# EAGLE design FilterTestBoard (EAGLE 9.2.1)
DESIGNER: Hendrik Melse; PART_NUMBER: 68-0011; PROJECT: Cougs In Space; REV: 1.0.0
Assembly variants: 0.1Hz/100Hz

## Sheet 1 of 2
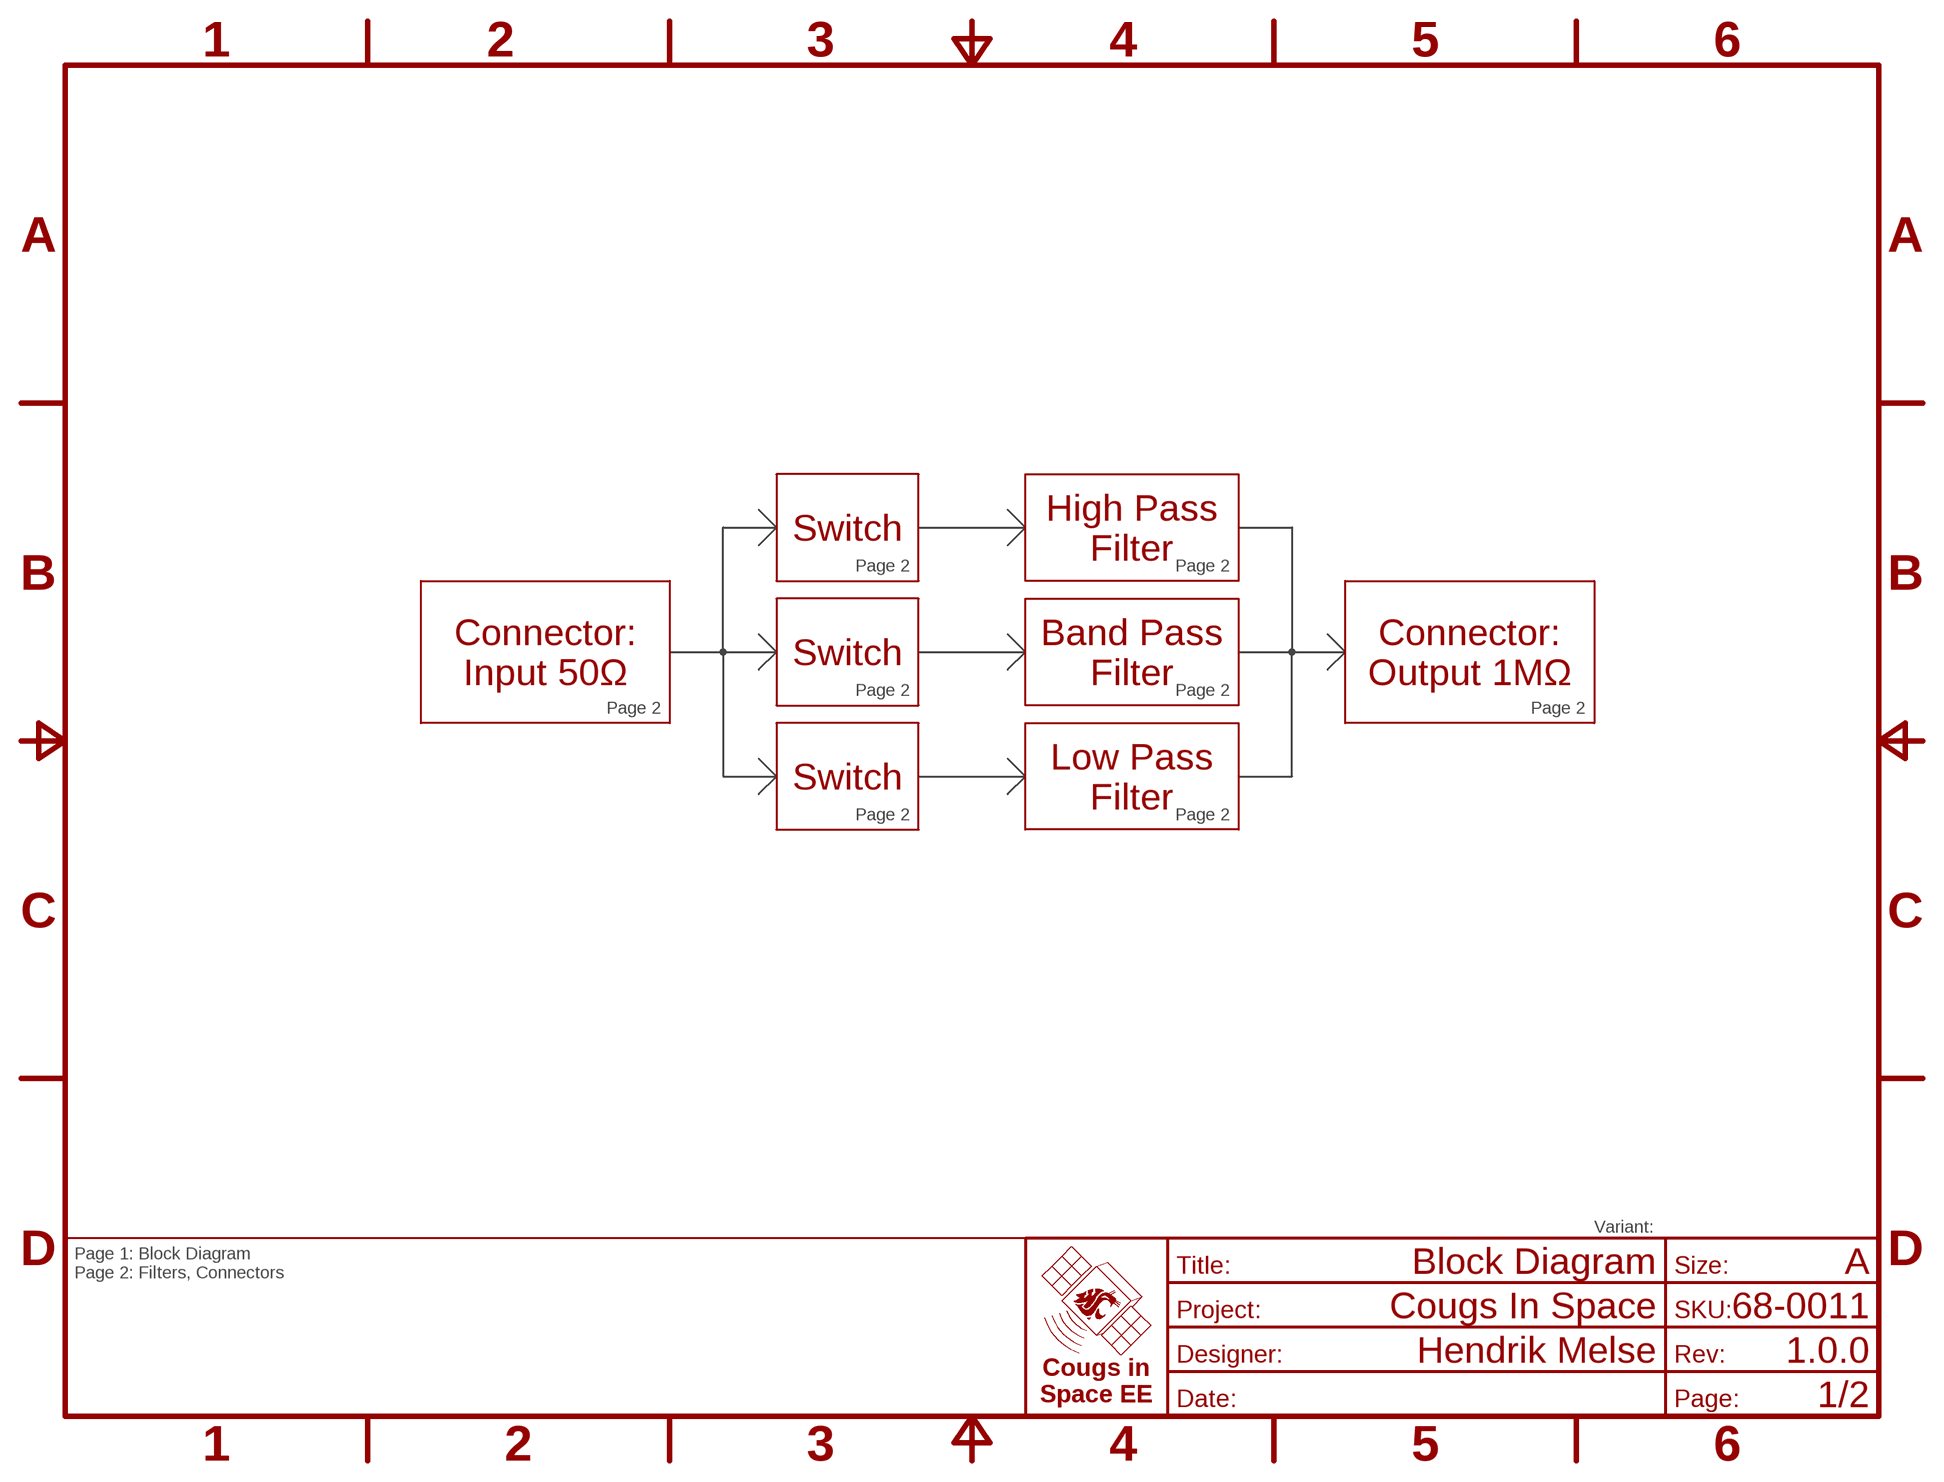
[diagram p0: schematic, sheet 1]
FRAME1 (FRAME-A): TITLE: Block Diagram

### Notes on the sheet
- Switch
- High Pass
  Filter
- Page 2 | Page 2
- Connector:
  Input 50Ω
- Switch
- Band Pass
  Filter
- Connector:
  Output 1MΩ
- Page 2 | Page 2
- Page 2 | Page 2
- Switch
- Low Pass
  Filter
- Page 2 | Page 2
- Variant:
- Page 1: Block Diagram
  Page 2: Filters, Connectors

## Sheet 2 of 2
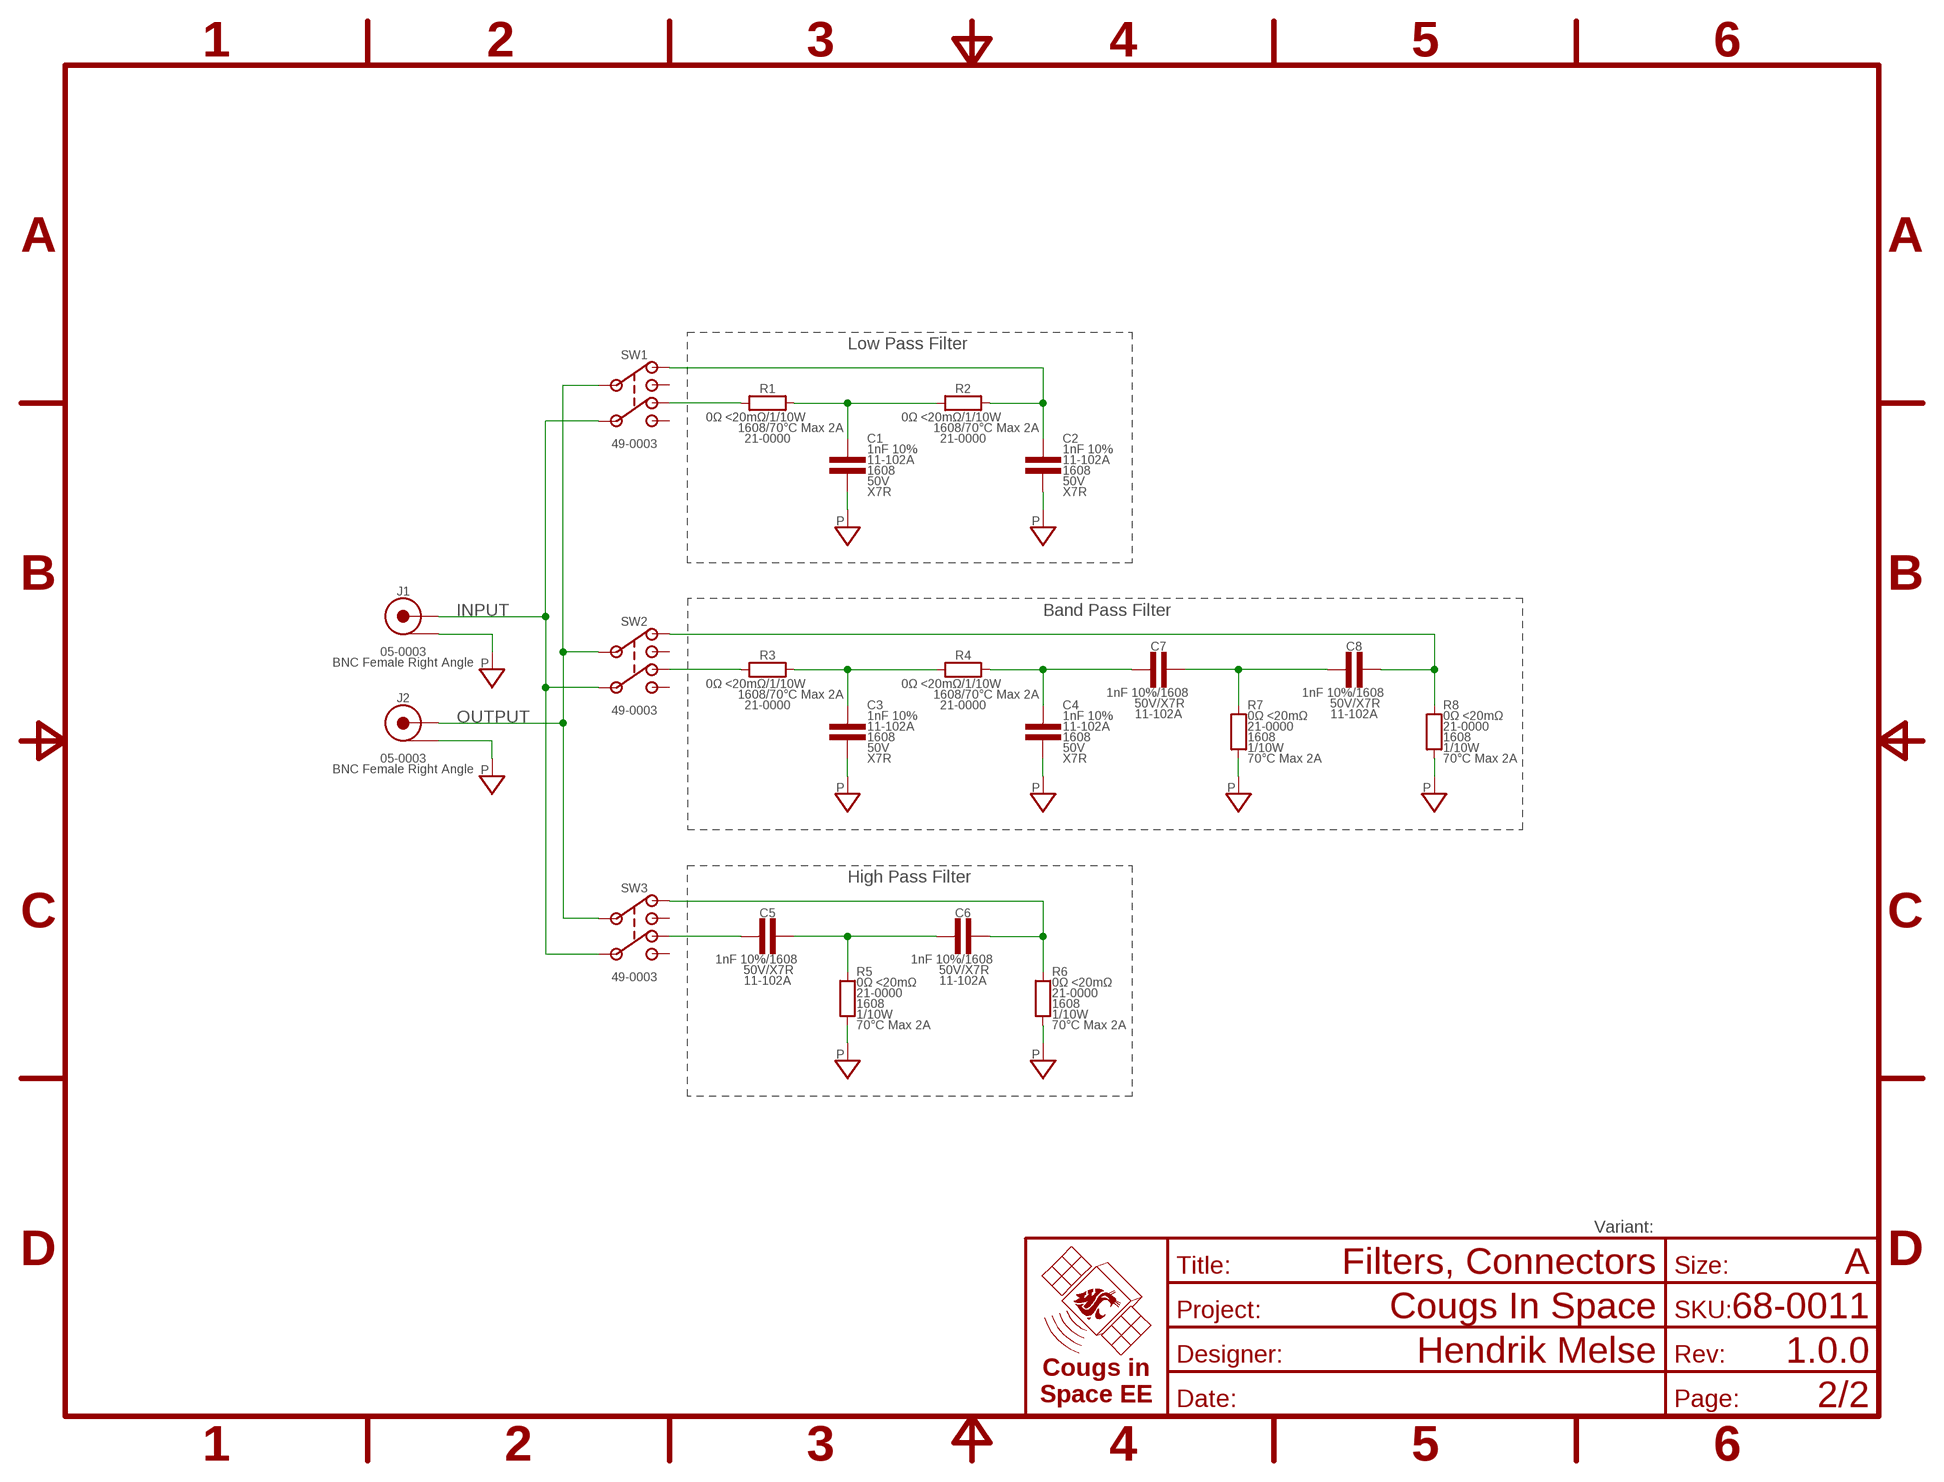
[diagram p1: schematic, sheet 2]
FRAME2 (FRAME-A): TITLE: Filters, Connectors

### Parts
C1  1nF 10%  CAP-V-1NF-1608  [1608]  (variant 0.1Hz/100Hz: 10µF 10%)
C2  1nF 10%  CAP-V-1NF-1608  [1608]  (variant 0.1Hz/100Hz: 10µF 10%)
C3  1nF 10%  CAP-V-1NF-1608  [1608]  (variant 0.1Hz/100Hz: 10µF 10%)
C4  1nF 10%  CAP-V-1NF-1608  [1608]  (variant 0.1Hz/100Hz: 10µF 10%)
C5  1nF 10%  CAP-H-1NF-1608  [1608]  (variant 0.1Hz/100Hz: 10µF 10%)
C6  1nF 10%  CAP-H-1NF-1608  [1608]  (variant 0.1Hz/100Hz: 10µF 10%)
C7  1nF 10%  CAP-H-1NF-1608  [1608]  (variant 0.1Hz/100Hz: 10µF 10%)
C8  1nF 10%  CAP-H-1NF-1608  [1608]  (variant 0.1Hz/100Hz: 10µF 10%)
J1  COAX-BNC-T-R  [BNC-T-R]
J2  COAX-BNC-T-R  [BNC-T-R]
R1  0Ω <20mΩ  RES-H-0-1608  [1608]  (variant 0.1Hz/100Hz: 158kΩ 0.1%)
R2  0Ω <20mΩ  RES-H-0-1608  [1608]  (variant 0.1Hz/100Hz: 158kΩ 0.1%)
R3  0Ω <20mΩ  RES-H-0-1608  [1608]  (variant 0.1Hz/100Hz: 158Ω 1%)
R4  0Ω <20mΩ  RES-H-0-1608  [1608]  (variant 0.1Hz/100Hz: 158Ω 1%)
R5  0Ω <20mΩ  RES-V-0-1608  [1608]  (variant 0.1Hz/100Hz: 158Ω 1%)
R6  0Ω <20mΩ  RES-V-0-1608  [1608]  (variant 0.1Hz/100Hz: 158Ω 1%)
R7  0Ω <20mΩ  RES-V-0-1608  [1608]  (variant 0.1Hz/100Hz: 158kΩ 0.1%)
R8  0Ω <20mΩ  RES-V-0-1608  [1608]  (variant 0.1Hz/100Hz: 158kΩ 0.1%)
SW1  SWITCH-DPDT-100DP1T1B1M2QE  [100DP1T1B1M2QE]
SW2  SWITCH-DPDT-100DP1T1B1M2QE  [100DP1T1B1M2QE]
SW3  SWITCH-DPDT-100DP1T1B1M2QE  [100DP1T1B1M2QE]

### Nets
BAND_IN: R3.1 SW2.1-B
BAND_INT0: C3.1 R3.2 R4.1
BAND_INT1: C4.1 C7.1 R4.2
BAND_INT2: C7.2 C8.1 R7.2
BAND_OUT: C8.2 R8.2 SW2.1-A
HIGH_IN: C5.1 SW3.1-B
HIGH_INT: C5.2 C6.1 R5.2
HIGH_OUT: C6.2 R6.2 SW3.1-A
INPUT: J1.CENTER SW1.COM-B SW2.COM-B SW3.COM-B
LOW_IN: R1.1 SW1.1-B
LOW_INT: C1.1 R1.2 R2.1
LOW_OUT: C2.1 R2.2 SW1.1-A
OUTPUT: J2.CENTER SW1.COM-A SW2.COM-A SW3.COM-A
PGND: C1.2 C2.2 C3.2 C4.2 J1.SHIELD J2.SHIELD R5.1 R6.1 R7.1 R8.1
Unconnected: SW1.2-A SW1.2-B SW2.2-A SW2.2-B SW3.2-A SW3.2-B

### Notes on the sheet
- Low Pass Filter
- Band Pass Filter
- High Pass Filter
- Variant:

## Library data of the parts
C1-C4 = CougsInSpace-Capacitors:CAP-V: Capacitor - Vertical Orientation; PACKAGE: 1608; SKU: 11-102A; TEMP: X7R; VOLTAGE: 50V
C5-C8 = CougsInSpace-Capacitors:CAP-H: Capacitor - Horizontal Orientation; PACKAGE: 1608; SKU: 11-102A; TEMP: X7R; VOLTAGE: 50V
J1 J2 = CougsInSpace-Connectors:COAX: Coax Connector; PACKAGE: BNC Female Right Angle; SKU: 05-0003
R1-R4 = CougsInSpace-Resistors:RES-H: Resistor Horizontal; PACKAGE: 1608; POWER: 1/10W; SKU: 21-0000; TEMP: 70°C Max 2A
R5-R8 = CougsInSpace-Resistors:RES-V: Resistor Vertical; PACKAGE: 1608; POWER: 1/10W; SKU: 21-0000; TEMP: 70°C Max 2A
SW1-SW3 = CougsInSpace-Switches:SWITCH-DPDT: Double Pole Double Throw - DPDT 100DP1T1B1M2QE <https://github.com/CougsInSpace/Resources/blob/master/SupplierDocuments/E-Switch/T121009_DPDT.pdf>; SKU: 49-0003

## Board
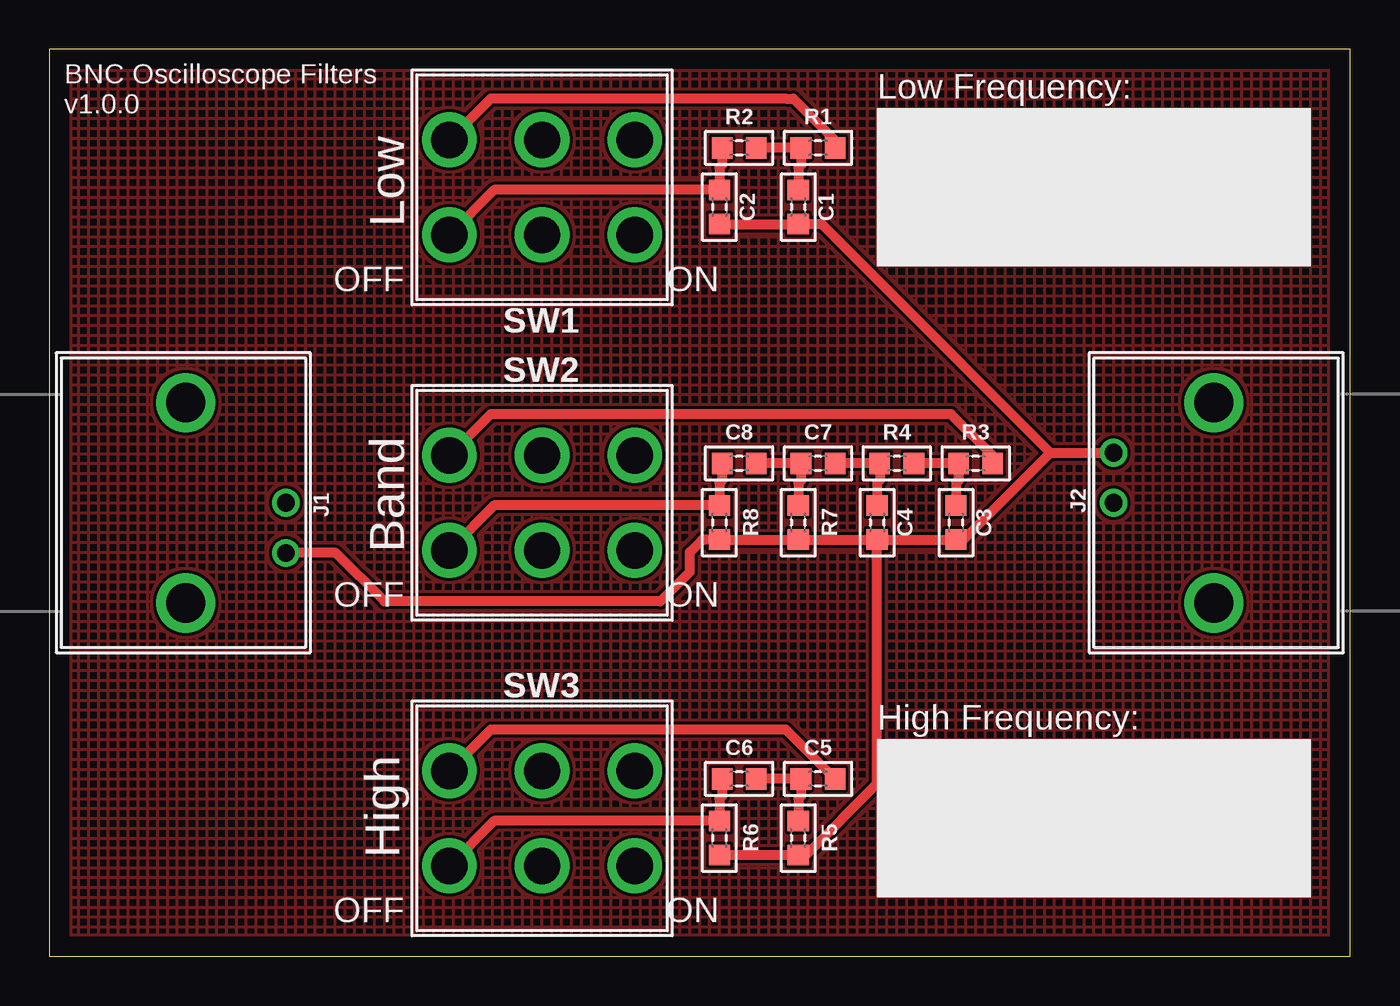
[diagram p2: board, top side]
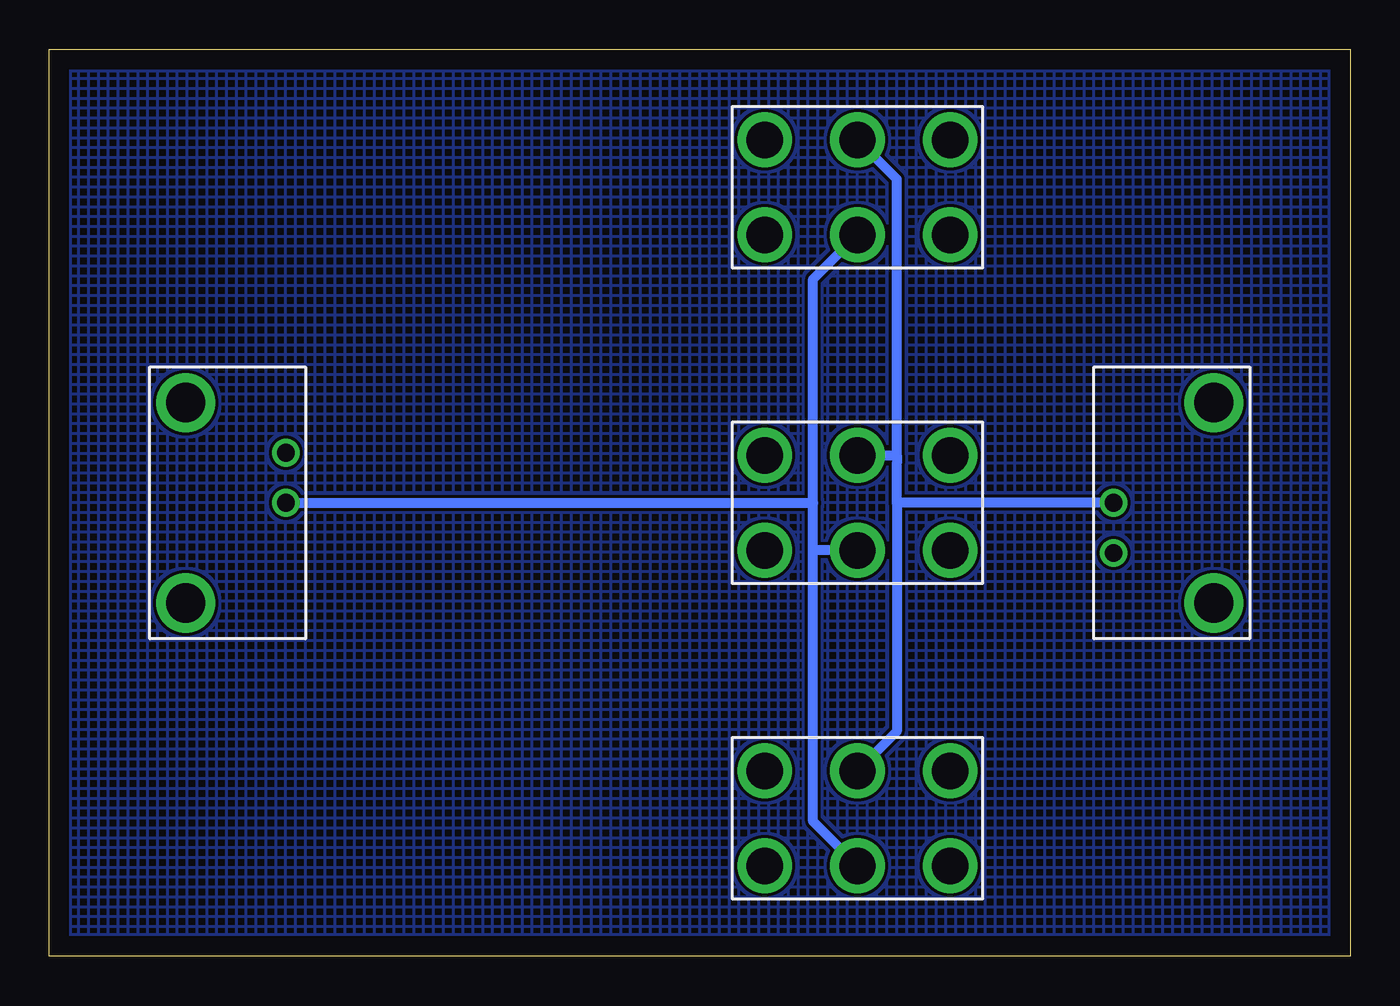
[diagram p3: board, bottom side, seen from below]

Size 66 x 46 mm. Coordinates in mm from the lower left corner, seen from the top.
Outline: 0,0 66,0 66,46 0,46 0,0
Copper layers (1*16): Top 0.035mm / dielectric 1.5mm / Bottom 0.035mm
Design rules "default": minimum track width 6mil, minimum drill 0.35mm, track to track 6mil, track to pad 6mil, pad to pad 6mil, via to via 6mil, smd to smd 6mil, copper to edge 40mil, drill to drill 6mil, minimum pad ring 10mil, minimum via ring 8mil, stop-mask expansion 4mil, vias tented up to drill 0mil, thermal gap 10mil

### Footprints (pad centres in the part's own frame; a part is rotated, then mirrored left to right if it is on the bottom)
1608 = smd 1.05 x 1.08: 1 -0.865,0; 2 0.865,0
BNC-T-R = drill 0.9: CENTER 0,0; SHIELD -2.54,0 | drill 2: MOUNTINGPOST@1 -5.08,5.08; MOUNTINGPOST@2 5.08,5.08
100DP1T1B1M2QE = drill 1.85: 1-A -2.41,4.7; 1-B 2.41,4.7; 2-A -2.41,-4.7; 2-B 2.41,-4.7; COM-A -2.41,0; COM-B 2.41,0

### Placement (x,y rotation side)
C1  10µF 10%  [1608]  38,38 270 top
C2  10µF 10%  [1608]  34,38 270 top
C3  10µF 10%  [1608]  46,22 270 top
C4  10µF 10%  [1608]  42,22 270 top
C5  10µF 10%  [1608]  39,9 180 top
C6  10µF 10%  [1608]  35,9 180 top
C7  10µF 10%  [1608]  39,25 180 top
C8  10µF 10%  [1608]  35,25 180 top
J1  12,23 90 top
J2  54,23 270 top
R1  158kΩ 0.1%  [1608]  39,41 180 top
R2  158kΩ 0.1%  [1608]  35,41 180 top
R3  158Ω 1%  [1608]  47,25 180 top
R4  158Ω 1%  [1608]  43,25 180 top
R5  158Ω 1%  [1608]  38,6 90 top
R6  158Ω 1%  [1608]  34,6 90 top
R7  158kΩ 0.1%  [1608]  38,22 90 top
R8  158kΩ 0.1%  [1608]  34,22 90 top
SW1  25,39 90 top
SW2  25,23 90 top
SW3  25,7 90 top

### Tracks (layer width: path | path; a pad name or v marks a point on that pad's centre or on a via)
BALANCING
  pour Top (hatched): 0,46 66,46 66,0 0,0
BALANCING_BOTTOM
  pour Bottom (hatched): 0,46 66,46 66,0 0,0
BAND_IN
  Top 0.5: R3.1 47.87,25.39 45.75,27.5 22.39,27.5 SW2.1-B
BAND_INT0
  Top 0.5: R4.1 R3.2 46.13,24.14 46,24 C3.1
BAND_INT1
  Top 0.5: C4.1 42,24 42.13,24.14 R4.2 C7.1
BAND_INT2
  Top 0.5: C8.1 C7.2 38.13,24.14 38,24 R7.2
BAND_OUT
  Top 0.5: C8.2 34.13,24.14 34,24 R8.2 22.57,22.86 SW2.1-A
HIGH_IN
  Top 0.5: C5.1 37.37,11.5 22.39,11.5 SW3.1-B
HIGH_INT
  Top 0.5: R5.2 38,8 38.13,8.13 C5.2 C6.1
HIGH_OUT
  Top 0.5: C6.2 34.13,8.13 34,8 R6.2 22.57,6.87 SW3.1-A
INPUT
  Bottom 0.5: J1.CENTER 23,23 | 23,23 23,25 23,25.41 | 23,25.41 23,39.41 SW1.COM-B | 23,23 23,11.41 SW3.COM-B | SW2.COM-B 23,25.41
LOW_IN
  Top 0.5: SW1.1-B 22.39,43.5 37,43.5 37.37,43.5 37.75,43.5 39.87,41.38 R1.1
LOW_INT
  Top 0.5: C1.1 38,40 38.13,40.13 R1.2 R2.1
LOW_OUT
  Top 0.5: R2.2 34.13,40.13 34,40 C2.1 22.57,38.87 SW1.1-A
OUTPUT
  Bottom 0.5: SW3.COM-A 27.25,6.84 27.25,20.59 | SW1.COM-A 27.25,34.34 27.25,23 | 27.25,20.59 27.25,23 | SW2.COM-A 27.25,20.59 | J2.CENTER 27.25,23
PGND
  Top 0.5: C4.2 R7.1 R8.1 33.13,21.14 32.5,20.5 32.5,19.5 31,18 17,18 14.54,20.46 J1.SHIELD | C4.2 C3.2 46.38,21.14 50.79,25.54 | C2.2 C1.2 39.2,37.13 50.79,25.54 | R6.1 R5.1 38.38,5.13 42,8.75 C4.2 | 50.79,25.54 J2.SHIELD

### Text on the board
tPlace: Low Frequency: | BNC Oscilloscope Filters / v1.0.0 | Low | OFF | ON | Band | OFF | ON | High Frequency: | High | OFF | ON